# Altium schematic sheet LED_Sch.SchDoc
size 635 x 342 mm
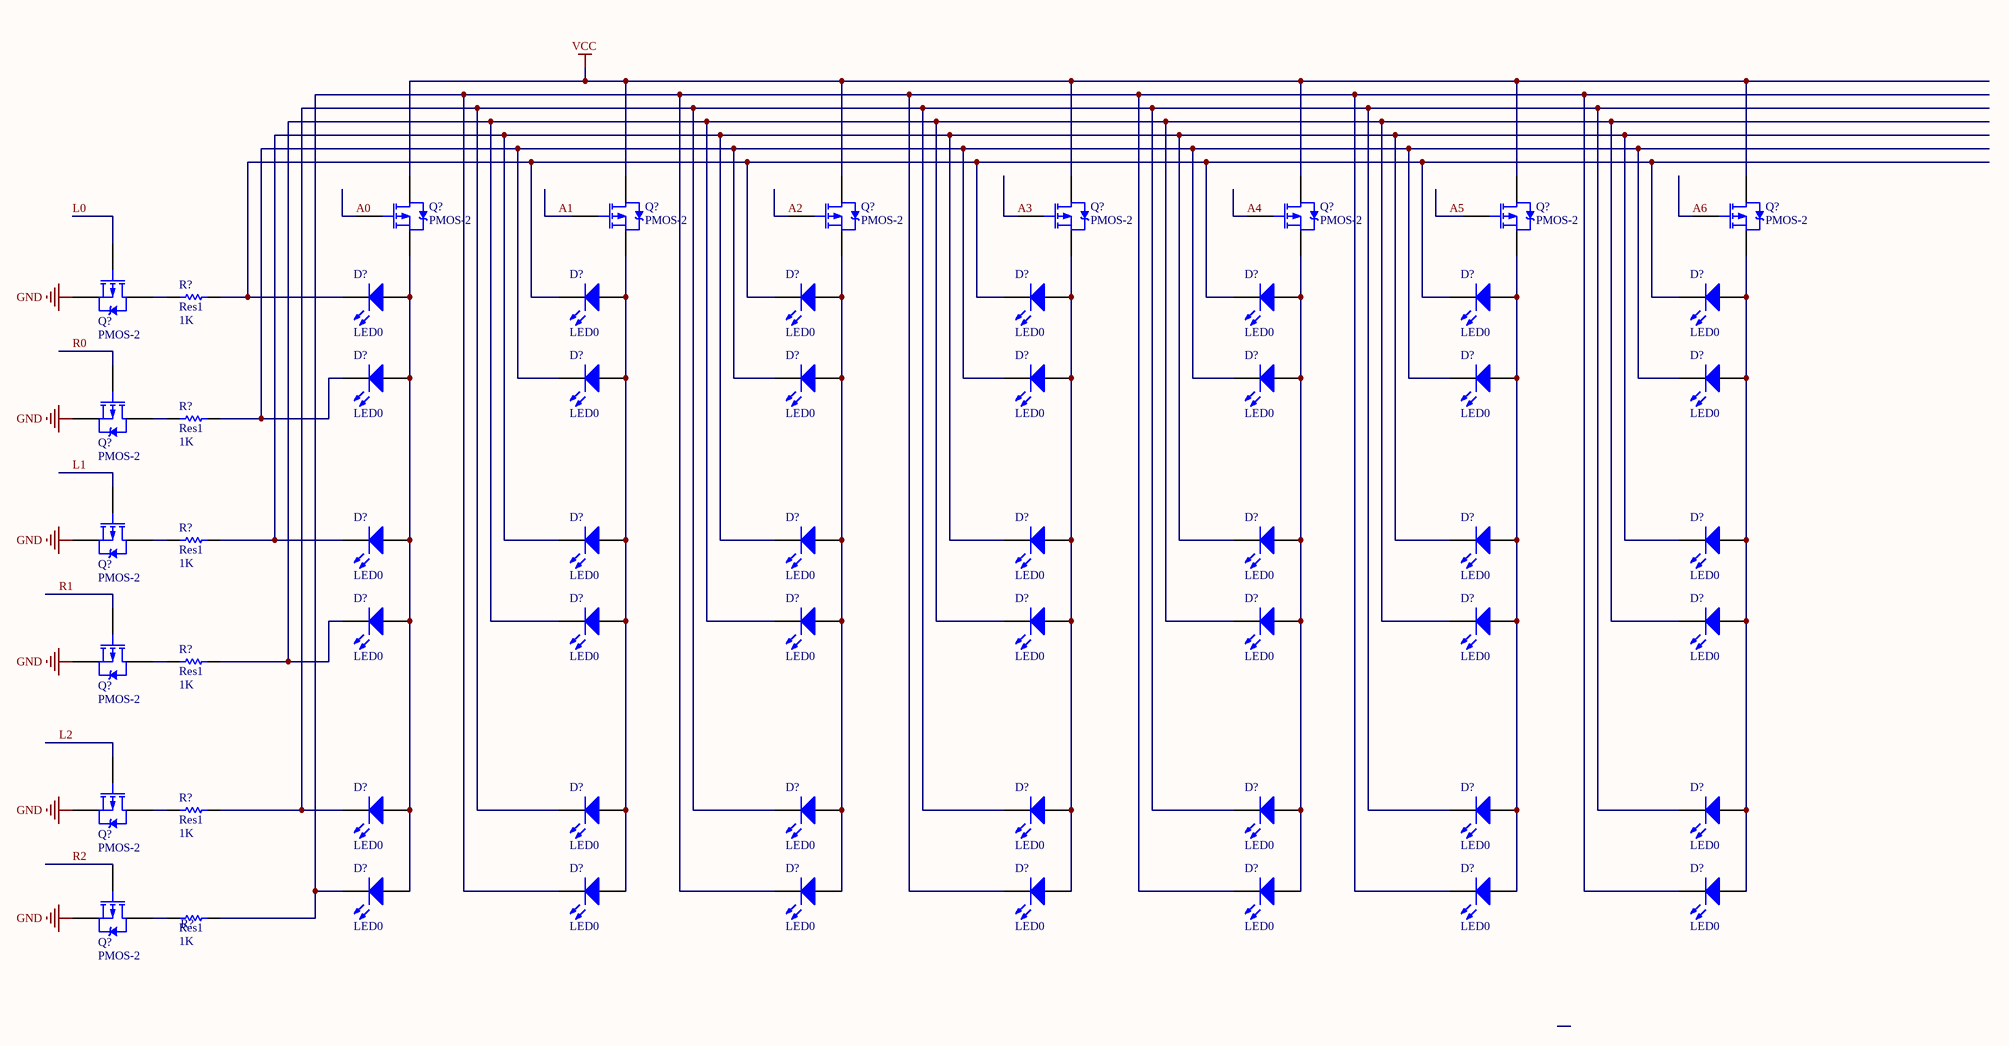
[diagram p0: LED_Sch.SchDoc]

## Parts
(Parts that share a designator on the sheet are numbered #1, #2 ... from top to bottom, then left to right.)
D?#1  LED0  [LED-0]
D?#2  LED0  [LED-0]
D?#3  LED0  [LED-0]
D?#4  LED0  [LED-0]
D?#5  LED0  [LED-0]
D?#6  LED0  [LED-0]
D?#7  LED0  [LED-0]
D?#8  LED0  [LED-0]
D?#9  LED0  [LED-0]
D?#10  LED0  [LED-0]
D?#11  LED0  [LED-0]
D?#12  LED0  [LED-0]
D?#13  LED0  [LED-0]
D?#14  LED0  [LED-0]
D?#15  LED0  [LED-0]
D?#16  LED0  [LED-0]
D?#17  LED0  [LED-0]
D?#18  LED0  [LED-0]
D?#19  LED0  [LED-0]
D?#20  LED0  [LED-0]
D?#21  LED0  [LED-0]
D?#22  LED0  [LED-0]
D?#23  LED0  [LED-0]
D?#24  LED0  [LED-0]
D?#25  LED0  [LED-0]
D?#26  LED0  [LED-0]
D?#27  LED0  [LED-0]
D?#28  LED0  [LED-0]
D?#29  LED0  [LED-0]
D?#30  LED0  [LED-0]
D?#31  LED0  [LED-0]
D?#32  LED0  [LED-0]
D?#33  LED0  [LED-0]
D?#34  LED0  [LED-0]
D?#35  LED0  [LED-0]
D?#36  LED0  [LED-0]
D?#37  LED0  [LED-0]
D?#38  LED0  [LED-0]
D?#39  LED0  [LED-0]
D?#40  LED0  [LED-0]
D?#41  LED0  [LED-0]
D?#42  LED0  [LED-0]
Q?#1  PMOS-2  [SFM-T3/A4.7V]
Q?#2  PMOS-2  [SFM-T3/A4.7V]
Q?#3  PMOS-2  [SFM-T3/A4.7V]
Q?#4  PMOS-2  [SFM-T3/A4.7V]
Q?#5  PMOS-2  [SFM-T3/A4.7V]
Q?#6  PMOS-2  [SFM-T3/A4.7V]
Q?#7  PMOS-2  [SFM-T3/A4.7V]
Q?#8  PMOS-2  [SFM-T3/A4.7V]
Q?#9  PMOS-2  [SFM-T3/A4.7V]
Q?#10  PMOS-2  [SFM-T3/A4.7V]
Q?#11  PMOS-2  [SFM-T3/A4.7V]
Q?#12  PMOS-2  [SFM-T3/A4.7V]
Q?#13  PMOS-2  [SFM-T3/A4.7V]
R?#1  Res1  value 1K  [AXIAL-0.3]
R?#2  Res1  value 1K  [AXIAL-0.3]
R?#3  Res1  value 1K  [AXIAL-0.3]
R?#4  Res1  value 1K  [AXIAL-0.3]
R?#5  Res1  value 1K  [AXIAL-0.3]
R?#6  Res1  value 1K  [AXIAL-0.3]

## Nets
GND: Q?#8.3(S) Q?#9.3(S) Q?#10.3(S) Q?#11.3(S) Q?#12.3(S) Q?#13.3(S)
VCC: Q?#1.2(D) Q?#2.2(D) Q?#3.2(D) Q?#4.2(D) Q?#5.2(D) Q?#6.2(D) Q?#7.2(D)
A0: Q?#1.1(G)
A1: Q?#2.1(G)
A2: Q?#3.1(G)
A3: Q?#4.1(G)
A4: Q?#5.1(G)
A5: Q?#6.1(G)
A6: Q?#7.1(G)
L0: Q?#8.1(G)
L1: Q?#10.1(G)
L2: Q?#12.1(G)
R0: Q?#9.1(G)
R1: Q?#11.1(G)
R2: Q?#13.1(G)
NetD?#1_1: D?#1.1(A) D?#8.1(A) D?#15.1(A) D?#22.1(A) D?#29.1(A) D?#36.1(A) Q?#1.3(S)
NetD?#1_2: D?#1.2(K) D?#2.2(K) D?#3.2(K) D?#4.2(K) D?#5.2(K) D?#6.2(K) D?#7.2(K) R?#1.2
NetD?#2_1: D?#2.1(A) D?#9.1(A) D?#16.1(A) D?#23.1(A) D?#30.1(A) D?#37.1(A) Q?#2.3(S)
NetD?#3_1: D?#3.1(A) D?#10.1(A) D?#17.1(A) D?#24.1(A) D?#31.1(A) D?#38.1(A) Q?#3.3(S)
NetD?#4_1: D?#4.1(A) D?#11.1(A) D?#18.1(A) D?#25.1(A) D?#32.1(A) D?#39.1(A) Q?#4.3(S)
NetD?#5_1: D?#5.1(A) D?#12.1(A) D?#19.1(A) D?#26.1(A) D?#33.1(A) D?#40.1(A) Q?#5.3(S)
NetD?#6_1: D?#6.1(A) D?#13.1(A) D?#20.1(A) D?#27.1(A) D?#34.1(A) D?#41.1(A) Q?#6.3(S)
NetD?#7_1: D?#7.1(A) D?#14.1(A) D?#21.1(A) D?#28.1(A) D?#35.1(A) D?#42.1(A) Q?#7.3(S)
NetD?#8_2: D?#8.2(K) D?#9.2(K) D?#10.2(K) D?#11.2(K) D?#12.2(K) D?#13.2(K) D?#14.2(K) R?#2.2
NetD?#15_2: D?#15.2(K) D?#16.2(K) D?#17.2(K) D?#18.2(K) D?#19.2(K) D?#20.2(K) D?#21.2(K) R?#3.2
NetD?#22_2: D?#22.2(K) D?#23.2(K) D?#24.2(K) D?#25.2(K) D?#26.2(K) D?#27.2(K) D?#28.2(K) R?#4.2
NetD?#29_2: D?#29.2(K) D?#30.2(K) D?#31.2(K) D?#32.2(K) D?#33.2(K) D?#34.2(K) D?#35.2(K) R?#5.2
NetD?#36_2: D?#36.2(K) D?#37.2(K) D?#38.2(K) D?#39.2(K) D?#40.2(K) D?#41.2(K) D?#42.2(K) R?#6.2
NetQ?#8_2: Q?#8.2(D) R?#1.1
NetQ?#9_2: Q?#9.2(D) R?#2.1
NetQ?#10_2: Q?#10.2(D) R?#3.1
NetQ?#11_2: Q?#11.2(D) R?#4.1
NetQ?#12_2: Q?#12.2(D) R?#5.1
NetQ?#13_2: Q?#13.2(D) R?#6.1

## Library data of the parts
D?#1-D?#42 = LED0: Typical INFRARED GaAs LED; Published: 8-Jun-2000; LatestRevisionDate: 08-Jul-2005; LatestRevisionNote: Mech Layer 1 removed.; PackageReference: LED-0; Publisher: Altium Limited; PackageDescription: LED; 2 Leads
Q?#1-Q?#13 = PMOS-2: P-Channel Power MOSFET; Note: Pin 4 not drawn and electrically connected to Pin 2.; Published: 8-Jun-2000; LatestRevisionDate: 17-Jul-2002; LatestRevisionNote: Re-released for DXP Platform.; DatasheetVersion: PD-9.390D; PackageReference: TO-220AB; Publisher: Altium Limited; Code_JEDEC: TO-220-AB; ComponentLink1Description: Manufacturer Link; ComponentLink1URL: http://www.irf.com/
R?#1-R?#6 = Res1: Resistor; Published: 8-Jun-2000; LatestRevisionDate: 17-Jul-2002; LatestRevisionNote: Re-released for DXP Platform.; PackageReference: AXIAL-0.3; Publisher: Altium Limited